# Altium project NPS.PrjPCB
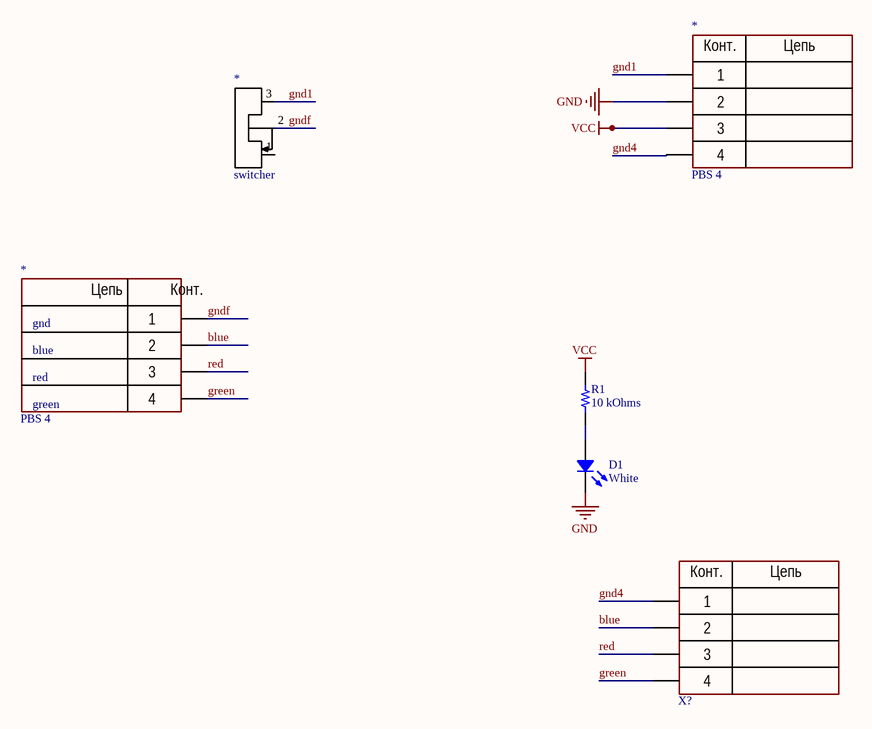
[diagram p0: NPS_sch.SchDoc]
1 sheet, 6 parts. Net scope: global (net labels, ports and power ports of the same name join across sheets).
Board files: NPS_pcb.PcbDoc, NS_pcb.PcbDoc, COMPRESSOR_pcb.PcbDoc

## Sheet NPS_sch.SchDoc
size A4

### Parts
(Parts that share a designator on the sheet are numbered #1, #2 ... from top to bottom, then left to right.)
*#1  PBS 4  [PBS-4 CUT]
*#2  switcher  [switcher]
*#3  PBS 4  [PBS-4 RIGHT ANGLE]
D1  White  [LED 1206_3216]
R1  10 kOhms  [RES 0603_1608]
X?  PLS 4  [pls-4 right angle]  (value not drawn)

### Nets
GND: *#1.2 D1.2
VCC: *#1.3 R1.1
blue: *#3.2 X?.2
gnd1: *#1.1 *#2.3
gnd4: *#1.4 X?.1
gndf: *#2.2 *#3.1
green: *#3.4 X?.4
red: *#3.3 X?.3
NetD1_1: D1.1 R1.2

Not connected (* = marked no-connect by the designer): *#2 1

### Notes on the sheet
- gnd
- blue
- red
- green
- (in symbol PBS 4) Конт.; Цепь
- (in symbol PLS 4) Конт.; Цепь

### Library data of the parts
D1 = SM1206NUWC-IL: LED WHITE DIFFUSED 1206 SMD; Manufacturer: Bivar Inc.; Configuration: Standard; Current - Test: 20mA; Lens Color: 1.40mm; Lens Size: 1.10mm Dia; Lens Style: Round with Flat Top; Millicandela Rating: 750mcd; Viewing Angle: 30°; Voltage - Forward (Vf) (Typ): 3.1V; Part Number: SM1206NUWC-IL; Color: White; ComponentLink1Description: Datasheet; ComponentLink1URL: https://www.bivar.com/Files/Datasheets/SM1206NUWC-IL.pdf; ComponentLink2Description: DigiKey Link; ComponentLink2URL: http://digikey.com/product-detail/en/bivar-inc/SM1206NUWC-IL/492-1946-1-ND/5030122; Device Package: 1206 (3216 Metric); Height (Max): 1.40mm; LastUpdated: 21.01.2020 3:32:32; Lens Transparency: Diffused; Lifecycle Status: Active; Minimum Order: 1; Mounting Type: Surface Mount; Package / Case: 1206 (3216 Metric); Packaging: TapeAndReel; PartId: 931; Part Status: Active; Price: 0.33; Series: -; Size / Dimension: 3.20mm L x 1.60mm W; Supplier 1: DigiKey; Supplier Part Number 1: 492-1946-1-ND; Supplier Device Package: 1206; Value: White
R1 = RNCS0603BKE10K0: RES 10K OHM 0.1% 1/16W 0603; Manufacturer: Stackpole Electronics Inc; Power (Watts): 0.063W, 1/16W; Temperature Coefficient: ±25ppm/°C; Part Number: RNCS0603BKE10K0; Value: 10 kOhms; ComponentLink1Description: Datasheet; ComponentLink1URL: https://www.seielect.com/catalog/sei-rncs_rnch.pdf; ComponentLink2Description: DigiKey Link; ComponentLink2URL: http://digikey.com/product-detail/en/stackpole-electronics-inc/RNCS0603BKE10K0/RNCS0603BKE10K0CT-ND/1800113; Composition: Thin Film; Device Package: 0603 (1608 Metric); Features: Anti-Corrosive, Automotive AEC-Q200, Moisture Resistant; Height - Seated (Max): 0.022" (0.55mm); LastUpdated: 21.01.2020 0:25:01; Lifecycle Status: Active; Minimum Order: 1; Number of Terminations: 2; Operating Temperature: -55°C ~ 155°C; Package / Case: 0603 (1608 Metric); Packaging: TapeAndReel; PartId: 4838; Part Status: Active; Price: 0.08; Ratings: AEC-Q200; Resistance: 10 kOhms; Series: RNCS; Size / Dimension: 0.061" L x 0.031" W (1.55mm x 0.80mm); Supplier 1: DigiKey; Supplier Part Number 1: RNCS0603BKE10K0CT-ND; Supplier Device Package: 0603; Tolerance: ±0.1%